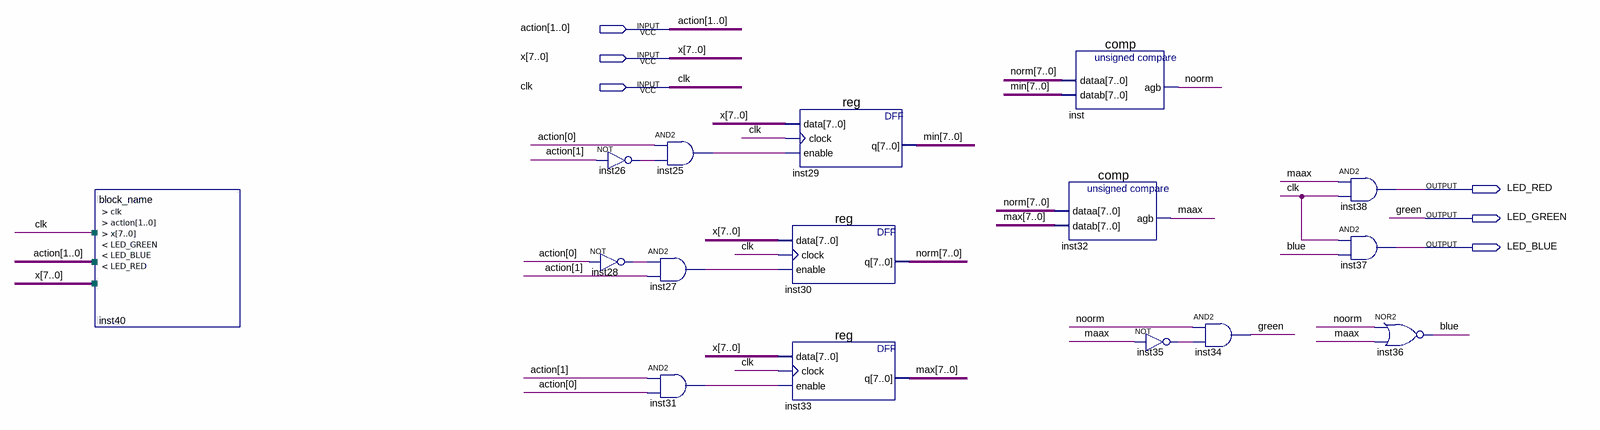
[diagram p0: schematic sheet]
// Quartus schematic sapr2.bdf as structural Verilog: 16 symbols, 6 pins
module sapr2 (
  input  [1:0] action,
  input  [7:0] x,
  input  clk,
  output LED_RED,
  output LED_GREEN,
  output LED_BLUE
);

  wire blue, inst25_out, inst26_out, inst27_out, inst28_out, inst31_out, inst35_out, maax, noorm;
  wire [7:0] max, min, norm;

  block_name inst40 (.clk(clk), .action(action), .x(x));  // open: LED_GREEN, LED_BLUE, LED_RED
  not inst26 (inst26_out, action[1]);
  not inst28 (inst28_out, action[0]);
  and inst25 (inst25_out, action[0], inst26_out);
  and inst27 (inst27_out, inst28_out, action[1]);
  and inst31 (inst31_out, action[1], action[0]);
  \reg  inst30 (.data(x), .clock(clk), .enable(inst27_out), .q(norm));
  \reg  inst33 (.data(x), .clock(clk), .enable(inst31_out), .q(max));
  \reg  inst29 (.data(x), .clock(clk), .enable(inst25_out), .q(min));
  comp inst (.dataa(norm), .datab(min), .agb(noorm));
  comp inst32 (.dataa(norm), .datab(max), .agb(maax));
  not inst35 (inst35_out, maax);
  and inst34 (LED_GREEN, noorm, inst35_out);
  and inst38 (LED_RED, maax, clk);
  and inst37 (LED_BLUE, clk, blue);
  nor inst36 (blue, noorm, maax);

  // Other names for the same wires on the sheet: green = LED_GREEN
endmodule
